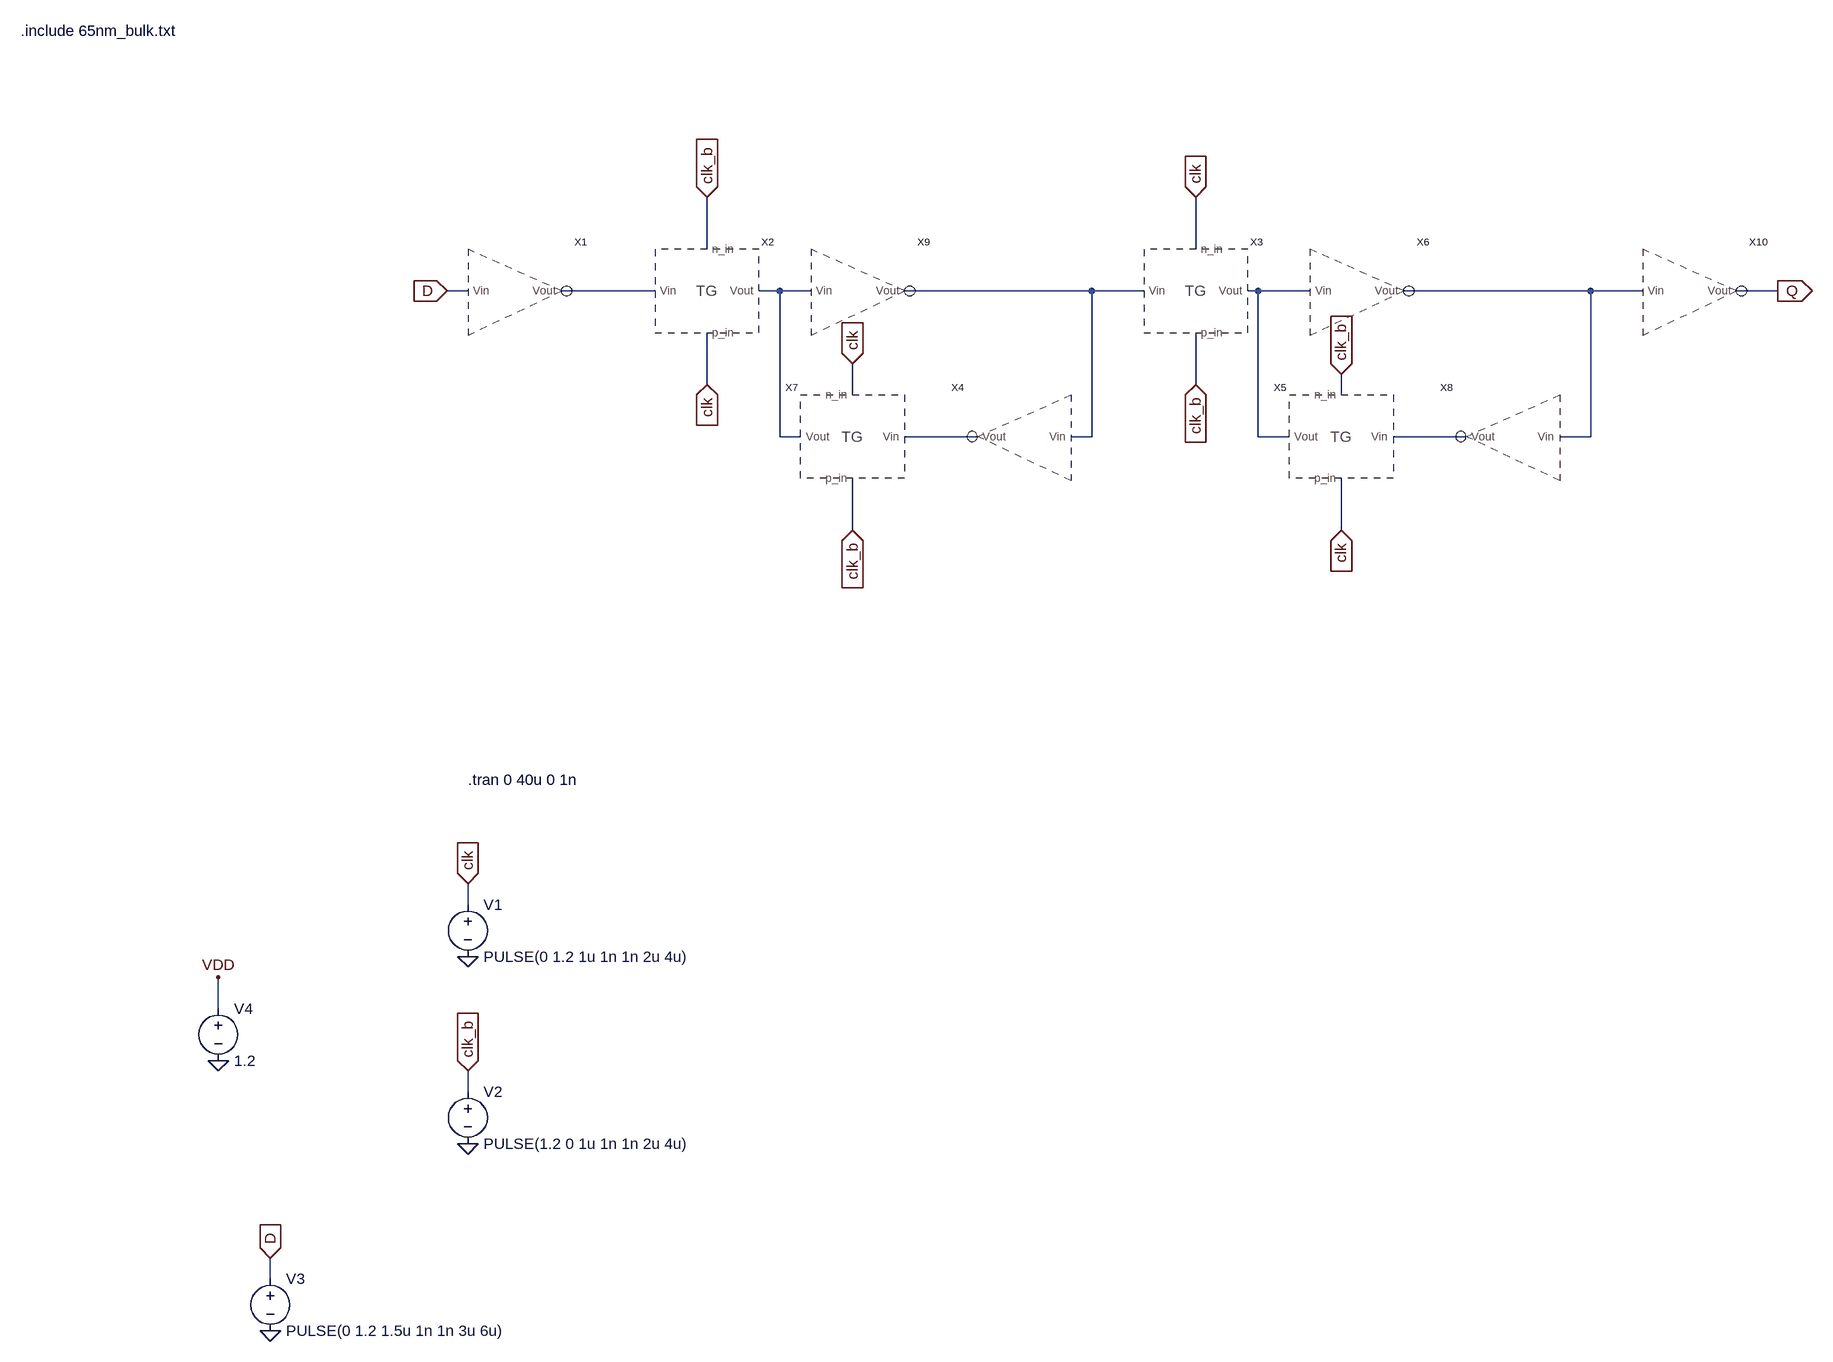
[diagram p0: schematic test1.asc]
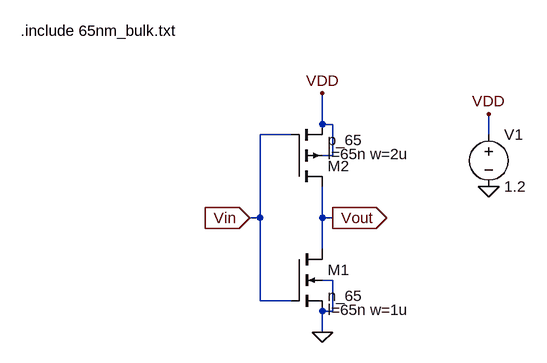
[diagram p1: sub-circuit inverter.asc]
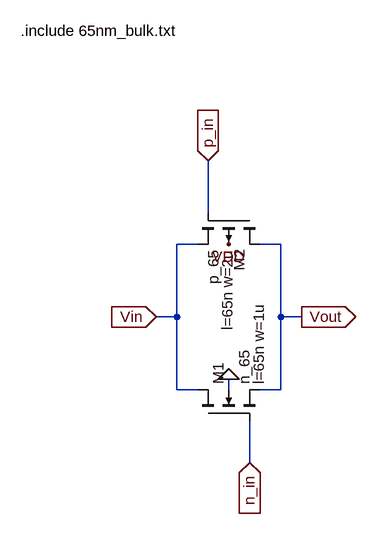
[diagram p2: sub-circuit transmission_gate.asc]
test1.asc, the LTspice schematic file:
Version 4
SHEET 1 2048 1920
WIRE 336 240 336 160
WIRE 1088 240 1088 160
WIRE -32 304 -64 304
WIRE 256 304 112 304
WIRE 448 304 416 304
WIRE 496 304 448 304
WIRE 928 304 640 304
WIRE 1008 304 928 304
WIRE 1184 304 1168 304
WIRE 1264 304 1184 304
WIRE 1696 304 1408 304
WIRE 1776 304 1696 304
WIRE 1984 304 1920 304
WIRE 336 448 336 368
WIRE 1088 448 1088 368
WIRE 560 464 560 416
WIRE 1312 464 1312 432
WIRE 448 528 448 304
WIRE 480 528 448 528
WIRE 752 528 640 528
WIRE 928 528 928 304
WIRE 928 528 896 528
WIRE 1184 528 1184 304
WIRE 1232 528 1184 528
WIRE 1504 528 1392 528
WIRE 1696 528 1696 304
WIRE 1696 528 1648 528
WIRE 560 672 560 592
WIRE 1312 672 1312 592
WIRE -32 1248 -32 1216
WIRE -416 1408 -416 1360
WIRE -32 1536 -32 1504
WIRE -336 1824 -336 1792
FLAG 336 160 clk_b
IOPIN 336 160 In
FLAG 336 448 clk
IOPIN 336 448 In
FLAG 1088 160 clk
IOPIN 1088 160 In
FLAG 1088 448 clk_b
IOPIN 1088 448 In
FLAG 1312 432 clk_b
IOPIN 1312 432 In
FLAG 1312 672 clk
IOPIN 1312 672 In
FLAG 560 416 clk
IOPIN 560 416 In
FLAG 560 672 clk_b
IOPIN 560 672 In
FLAG -64 304 D
IOPIN -64 304 In
FLAG 1984 304 Q
IOPIN 1984 304 Out
FLAG -32 1216 clk
IOPIN -32 1216 In
FLAG -32 1328 0
FLAG -32 1504 clk_b
IOPIN -32 1504 In
FLAG -32 1616 0
FLAG -336 1792 D
IOPIN -336 1792 In
FLAG -336 1904 0
FLAG -416 1360 VDD
FLAG -416 1488 0
SYMBOL inverter 32 304 R0
SYMATTR InstName X1
SYMBOL inverter 832 528 M0
SYMATTR InstName X4
SYMBOL inverter 1584 528 M0
SYMATTR InstName X8
SYMBOL inverter 560 304 R0
SYMATTR InstName X9
SYMBOL inverter 1328 304 R0
SYMATTR InstName X6
SYMBOL inverter 1840 304 R0
SYMATTR InstName X10
SYMBOL transmission_gate 336 304 R0
SYMATTR InstName X2
SYMBOL transmission_gate 1088 304 R0
SYMATTR InstName X3
SYMBOL transmission_gate 1312 528 M0
SYMATTR InstName X5
SYMBOL transmission_gate 560 528 M0
SYMATTR InstName X7
SYMBOL Voltage -32 1232 R0
SYMATTR InstName V1
SYMATTR Value PULSE(0 1.2 1u 1n 1n 2u 4u)
SYMBOL Voltage -32 1520 R0
SYMATTR InstName V2
SYMATTR Value PULSE(1.2 0 1u 1n 1n 2u 4u)
SYMBOL Voltage -336 1808 R0
SYMATTR InstName V3
SYMATTR Value PULSE(0 1.2 1.5u 1n 1n 3u 6u)
SYMBOL Voltage -416 1392 R0
SYMATTR InstName V4
SYMATTR Value 1.2
TEXT -720 -96 Left 2 !.include 65nm_bulk.txt
TEXT -32 1056 Left 2 !.tran 0 40u 0 1n

inverter.asc, the sub-circuit schematic file:
Version 4
SHEET 1 880 680
WIRE 400 224 400 176
WIRE 416 224 400 224
WIRE 352 240 304 240
WIRE 656 240 656 208
WIRE 416 272 416 224
WIRE 416 272 400 272
WIRE 304 368 304 240
WIRE 304 368 288 368
WIRE 400 368 400 320
WIRE 416 368 400 368
WIRE 400 416 400 368
WIRE 416 464 400 464
WIRE 304 496 304 368
WIRE 352 496 304 496
WIRE 416 512 416 464
WIRE 416 512 400 512
WIRE 400 544 400 512
FLAG 400 544 0
FLAG 400 176 VDD
FLAG 656 208 VDD
FLAG 656 320 0
FLAG 288 368 Vin
IOPIN 288 368 In
FLAG 416 368 Vout
IOPIN 416 368 Out
SYMBOL nmos4 352 416 R0
WINDOW 123 56 94 Left 2
SYMATTR InstName M1
SYMATTR Value n_65
SYMATTR Value2 l=65n w=1u
SYMBOL pmos4 352 320 M180
WINDOW 123 56 50 Left 2
SYMATTR InstName M2
SYMATTR Value p_65
SYMATTR Value2 l=65n w=2u
SYMBOL Voltage 656 224 R0
SYMATTR InstName V1
SYMATTR Value 1.2
TEXT -64 80 Left 2 !.include 65nm_bulk.txt

transmission_gate.asc, the sub-circuit schematic file:
Version 4
SHEET 1 880 924
WIRE 64 368 64 288
WIRE 48 416 16 416
WIRE 176 416 144 416
WIRE 16 528 16 416
WIRE 16 528 -16 528
WIRE 176 528 176 416
WIRE 208 528 176 528
WIRE 16 640 16 528
WIRE 48 640 16 640
WIRE 96 640 96 624
WIRE 176 640 176 528
WIRE 176 640 144 640
WIRE 128 752 128 688
FLAG 96 624 0
FLAG 96 416 VDD
FLAG 128 752 n_in
IOPIN 128 752 In
FLAG 64 288 p_in
IOPIN 64 288 In
FLAG -16 528 Vin
IOPIN -16 528 In
FLAG 208 528 Vout
IOPIN 208 528 Out
SYMBOL nmos4 48 688 R270
WINDOW 123 56 94 Left 2
SYMATTR Value2 l=65n w=1u
SYMATTR InstName M1
SYMATTR Value n_65
SYMBOL pmos4 144 368 R90
WINDOW 123 56 50 Left 2
SYMATTR Value2 l=65n w=2u
SYMATTR InstName M2
SYMATTR Value p_65
TEXT -224 88 Left 2 !.include 65nm_bulk.txt

The netlist it stands for:
* test1.asc
XX1 D N001 inverter
XX4 N003 N006 inverter
XX8 N005 N007 inverter
XX9 N002 N003 inverter
XX6 N004 N005 inverter
XX10 N005 Q inverter
XX2 clk_b clk N001 N002 transmission_gate
XX3 clk clk_b N003 N004 transmission_gate
XX5 clk_b clk N007 N004 transmission_gate
XX7 clk clk_b N006 N002 transmission_gate
V1 clk 0 PULSE(0 1.2 1u 1n 1n 2u 4u)
V2 clk_b 0 PULSE(1.2 0 1u 1n 1n 2u 4u)
V3 D 0 PULSE(0 1.2 1.5u 1n 1n 3u 6u)
V4 VDD 0 1.2

* block symbol definitions
.subckt inverter Vin Vout
M1 Vout Vin 0 0 n_65 l=65n w=1u
M2 Vout Vin VDD VDD p_65 l=65n w=2u
V1 VDD 0 1.2
.include 65nm_bulk.txt
.ends inverter

.subckt transmission_gate n_in p_in Vin Vout
M1 Vin n_in Vout 0 n_65 l=65n w=1u
M2 Vout p_in Vin VDD p_65 l=65n w=2u
.include 65nm_bulk.txt
.ends transmission_gate

.model NMOS NMOS
.model PMOS PMOS
.lib standard.mos
.include 65nm_bulk.txt
.tran 0 40u 0 1n
.backanno
.end